# Altium schematic sheet Motor-Y.SchDoc: Motor-Y
size Letter; DocumentNumber: 3; SheetNumber: 6; SheetTotal: 11
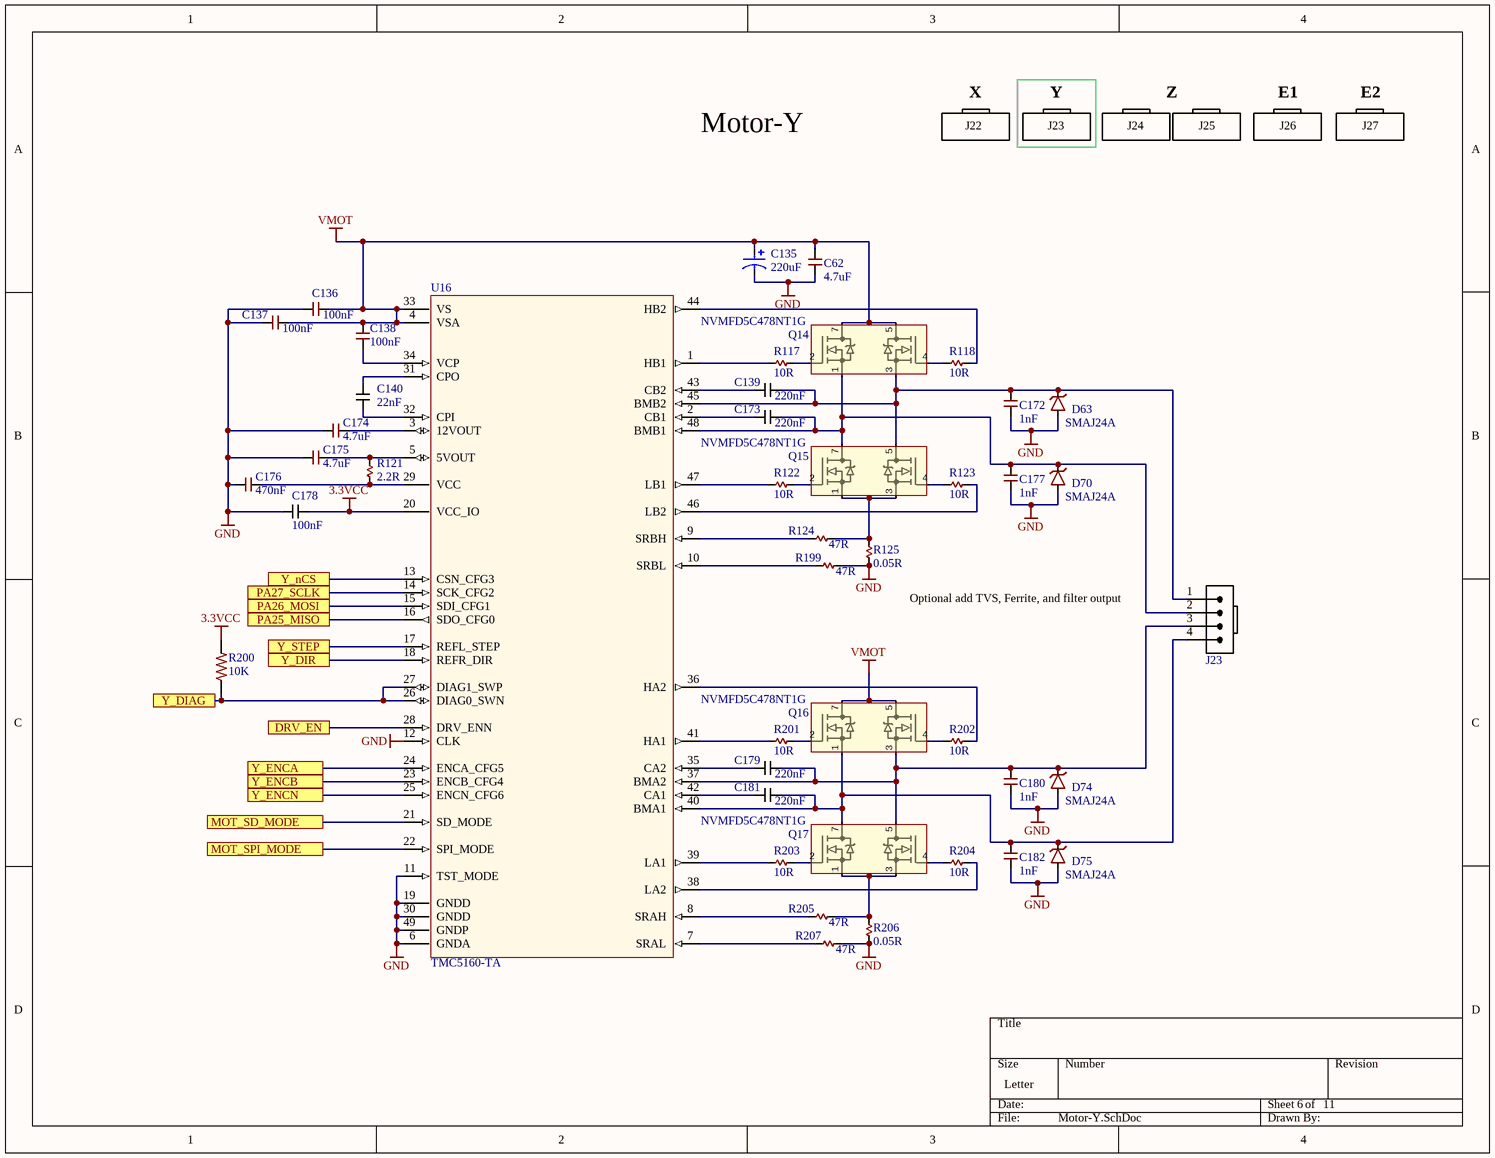
[diagram p0: Motor-Y.SchDoc]

## Parts
C62  4.7uF  [C1206]
C135  220uF  [CAP10X10]
C136  100nF  [C0603]
C137  100nF  [C0603]
C138  100nF  [C0603]
C139  220nF  [C0603]
C140  22nF  [C0603]
C172  1nF  [C0603]
C173  220nF  [C0603]
C174  4.7uF  [C1206]
C175  value 4.7uF  [C0603]  (hidden comment: 4.7uF 6.3V 0603)
C176  value 470nF  [C0402]  (hidden comment: 0402)
C177  1nF  [C0603]
C178  100nF  [C0201 Large Pads]
C179  220nF  [C0603]
C180  1nF  [C0603]
C181  220nF  [C0603]
C182  1nF  [C0603]
D63  SMAJ24A  [SMA-SM]
D70  SMAJ24A  [SMA-SM]
D74  SMAJ24A  [SMA-SM]
D75  SMAJ24A  [SMA-SM]
J23  Molex 0705430003  [4POL254 PIN-IN-PASTE]  (value not drawn)
Q14  NVMFD5C478NT1G  [SO8FL-Dual (DFN8 5x6, 1.26P Dual Flag)]
Q15  NVMFD5C478NT1G  [SO8FL-Dual (DFN8 5x6, 1.26P Dual Flag)]
Q16  NVMFD5C478NT1G  [SO8FL-Dual (DFN8 5x6, 1.26P Dual Flag)]
Q17  NVMFD5C478NT1G  [SO8FL-Dual (DFN8 5x6, 1.26P Dual Flag)]
R117  10R  [R0402]
R118  10R  [R0402]
R121  2.2R  [R0402]
R122  10R  [R0402]
R123  10R  [R0402]
R124  47R  [R0402]
R125  0.05R  [R2512]
R199  47R  [R0402]
R200  10K  [R0402]
R201  10R  [R0402]
R202  10R  [R0402]
R203  10R  [R0402]
R204  10R  [R0402]
R205  47R  [R0402]
R206  0.05R  [R2512]
R207  47R  [R0402]
U16  TMC5160-TA  [TQFP48-EP]

## Ports
DRV_EN, MOT_SD_MODE, MOT_SPI_MODE, PA25_MISO, PA26_MOSI, PA27_SCLK, Y_DIAG, Y_DIR, Y_ENCA, Y_ENCB, Y_ENCN, Y_nCS, Y_STEP

## Nets
3.3VCC: C178.2 R200.2 U16.20(VCC_IO)
GND: C62.1 C135.2 C136.1 C137.1 C172.1 C174.1 C175.1 C176.1 C177.1 C178.1 C180.1 C182.1 D63.A D70.A D74.A D75.A R125.1 R199.2 R206.1 R207.2 U16.6(GNDA) U16.11(TST_MODE) U16.12(CLK) U16.19(GNDD) U16.30(GNDD) U16.49(GNDP)
VMOT: C62.2 C135.1 C136.2 C137.2 C138.2 Q14.5(D1) Q14.7(D2) Q16.5(D1) Q16.7(D2) U16.4(VSA) U16.33(VS)
DRV_EN: U16.28(DRV_ENN) ; port DRV_EN
MOT_SD_MODE: U16.21(SD_MODE) ; port MOT_SD_MODE
MOT_SPI_MODE: U16.22(SPI_MODE) ; port MOT_SPI_MODE
PA25_MISO: U16.16(SDO_CFG0) ; port PA25_MISO
PA26_MOSI: U16.15(SDI_CFG1) ; port PA26_MOSI
PA27_SCLK: U16.14(SCK_CFG2) ; port PA27_SCLK
Y_DIAG: R200.1 U16.26(DIAG0_SWN) U16.27(DIAG1_SWP) ; port Y_DIAG
Y_DIR: U16.18(REFR_DIR) ; port Y_DIR
Y_ENCA: U16.24(ENCA_CFG5) ; port Y_ENCA
Y_ENCB: U16.23(ENCB_CFG4) ; port Y_ENCB
Y_ENCN: U16.25(ENCN_CFG6) ; port Y_ENCN
Y_nCS: U16.13(CSN_CFG3) ; port Y_nCS
Y_STEP: U16.17(REFL_STEP) ; port Y_STEP
NetC138_1: C138.1 U16.34(VCP)
NetC139_1: C139.1 U16.43(CB2)
NetC139_2: C139.2 C172.2 D63.K J23.1 Q14.3(S1) Q15.5(D1) U16.45(BMB2)
NetC140_1: C140.1 U16.32(CPI)
NetC140_2: C140.2 U16.31(CPO)
NetC173_1: C173.1 U16.2(CB1)
NetC173_2: C173.2 C177.2 D70.K J23.2 Q14.1(S2) Q15.7(D2) U16.48(BMB1)
NetC174_2: C174.2 U16.3(12VOUT)
NetC175_2: C175.2 R121.2 U16.5(5VOUT)
NetC176_2: C176.2 R121.1 U16.29(VCC)
NetC179_1: C179.1 U16.35(CA2)
NetC179_2: C179.2 C180.2 D74.K J23.3 Q16.3(S1) Q17.5(D1) U16.37(BMA2)
NetC181_1: C181.1 U16.42(CA1)
NetC181_2: C181.2 C182.2 D75.K J23.4 Q16.1(S2) Q17.7(D2) U16.40(BMA1)
NetQ14_2: Q14.2(G2) R117.2
NetQ14_4: Q14.4(G1) R118.1
NetQ15_1: Q15.1(S2) Q15.3(S1) R124.2 R125.2
NetQ15_2: Q15.2(G2) R122.2
NetQ15_4: Q15.4(G1) R123.1
NetQ16_2: Q16.2(G2) R201.2
NetQ16_4: Q16.4(G1) R202.1
NetQ17_1: Q17.1(S2) Q17.3(S1) R205.2 R206.2
NetQ17_2: Q17.2(G2) R203.2
NetQ17_4: Q17.4(G1) R204.1
NetR117_1: R117.1 U16.1(HB1)
NetR118_2: R118.2 U16.44(HB2)
NetR122_1: R122.1 U16.47(LB1)
NetR123_2: R123.2 U16.46(LB2)
NetR124_1: R124.1 U16.9(SRBH)
NetR199_1: R199.1 U16.10(SRBL)
NetR201_1: R201.1 U16.41(HA1)
NetR202_2: R202.2 U16.36(HA2)
NetR203_1: R203.1 U16.39(LA1)
NetR204_2: R204.2 U16.38(LA2)
NetR205_1: R205.1 U16.8(SRAH)
NetR207_1: R207.1 U16.7(SRAL)

## Notes on the sheet
- X
- Y
- Z
- E1
- E2
- Motor-Y
- J22
- J23
- J24
- J25
- J26
- J27
- (near J23) Optional add TVS, Ferrite, and filter output

## Library data of the parts
C62 C174 = 4.7uF 1206 50V X5R: CAP CER 1206 4.7uF 50V 10% X5R; MANUFACTURER: Kemet; MANUFACTURER #: C1206C475K5PACTU; PART: 4.7uF 50V X5R 1206; PART DESCRIPTION: 4.7µF ±10% 50V Ceramic Capacitor X5R 1206 (3216 Metric); DISTRIBUTOR #: 399-5507-2-ND; DISTRIBUTOR: Digikey; TOLERANCE: 10%; EE_SPEC: 50V; VALUE: 4.7uF
C135 = 220uF Al-El 50V: CAP ALUM 220UF 20% 50V SMD; MANUFACTURER #: UCW1H221MNL1GS; MANUFACTURER: Nichicon; PART DESCRIPTION: 220µF 50V Aluminum Electrolytic Capacitors Radial, Can - SMD 7000 Hrs @ 105°C; EE_SPEC: 365mA@120Hz 730mA@100kHz 350mOhms; DISTRIBUTOR #: 493-9426-2-ND; DISTRIBUTOR: Digikey; PART: 220uF; TOLERANCE: 20%; VALUE: 220uF
C136-C138 = 100nF 0603 50V X7R: CAP CER 0603 100nF 50V 10% X7R; MANUFACTURER: Kemet; MANUFACTURER #: C0603C104K5RACTU; PART: 100nF 50V X7R 0603; PART DESCRIPTION: 0.10µF ±10% 50V Ceramic Capacitor X7R 0603 (1608 Metric); DISTRIBUTOR #: 399-5089-2-ND; DISTRIBUTOR: Digikey; TOLERANCE: 10%; EE_SPEC: 50V; VALUE: 100nF
C139 C173 C179 C181 = 220nF 50V X7R 0603: CAP CER 0.22UF 50V X7R 0603; MANUFACTURER: TDK; MANUFACTURER #: CGA3E3X7R1H224K080AB; PART DESCRIPTION: 0.22µF ±10% 50V Ceramic Capacitor X7R 0603 (1608 Metric); EE_SPEC: 50V X7R; VALUE: 220nF
C140 = 22nF 100V X7R 0603: CAP CER 0.022UF 100V X7R 0603; MANUFACTURER: Kemet; MANUFACTURER #: C0603C223K1RACTU; PART DESCRIPTION: 0.022µF ±10% 100V Ceramic Capacitor X7R 0603 (1608 Metric); EE_SPEC: 100 X7R; VALUE: 22nF
C172 C177 C180 C182 = 1nF 50V X7R 0603: CAP CER 0603  1nF 50v 10% X7R; Manufacturer: Kemet; MANUFACTURER #: C0603C102K5RACTU; Part Description: 1000pF ±10% 50V Ceramic Capacitor X7R 0603 (1608 Metric); Tolerance: +/- 10%; VALUE: 1nF; DISTRIBUTOR #: 399-1082-2-ND; DISTRIBUTOR: Digi-Key; EE_SPEC: 1nF 50V X7R 0603; PART: 1nF
C175 = 4.7uF 0603 6.3V X7R: CAP CER 4.7UF 6.3V X7R 0603; MANUFACTURER: Samsung; MANUFACTURER #: CL10B475KQ8NQNC; PART DESCRIPTION: 4.7µF ±10% 6.3V Ceramic Capacitor X7R 0603 (1608 Metric); TOLERANCE: 10%; DISTRIBUTOR #: 1276-2087-2-ND; DISTRIBUTOR: Digikey; PART: 4.7uF; EE_SPEC: 6.3V
C176 = 470nF 0402 6.3V X5R: 470nF 6.3v C0402 - GRM155R60J474KE19D; PART DESCRIPTION: 470nF ±10% 6.3V Ceramic Capacitor X5R 0402 (1005 Metric); MANUFACTURER: Murata; PART: 0.47uF 6.3V X5R 0402; TOLERANCE: 10%; EE_SPEC: 6.3V; MANUFACTURER #: GRM155R60J474KE19D; DISTRIBUTOR #: 490-3266-2-ND; DISTRIBUTOR: Digikey
C178 = 100nF 6.3V X5R 0201: CAP CER 0.1UF 6.3V 10% X5R 0201; MANUFACTURER: Samsung; MANUFACTURER #: CL03A104KQ3NNNC; VALUE: 100nF; DISTRIBUTOR: DIGI-KEY; DISTRIBUTOR #: 1276-1013-1-ND; TOLERANCE: 10%; VOLTAGE: 6.3V
D63 D70 D74 D75 = SMAJ24A: TVS DIODE 24V 38.9V SMA; Manufacturer: Bourns Inc; EE_SPEC: 24Vrs 38.9Vc; MANUFACTURER #: SMAJ24A; DISTRIBUTOR #: SMAJ24ABTR-ND; DISTRIBUTOR: Digi-Key; Part Description: TVS DIODE 24V 38.9V SMA; VALUE: SMAJ24A
J23 = Molex 0705430003 PIP: Molex 4 Pin Clip Connector - Pin In Paste footprint
Q14-Q17 = NVMFD5C478NT1G: 40V 17 MOHM T6 S08FL DUAL; MANUFACTURER: ON Semiconductor; PART DESCRIPTION: Mosfet Array 2 N-Channel (Dual) 40V 9.8A (Ta), 27A (Tc) 3.1W (Ta), 23W (Tc) Surface Mount 8-DFN (5x6) Dual Flag (SO8FL-Dual); TOLERANCE: -NA-; MANUFACTURER #: NVMFD5C478NT1G; DISTRIBUTOR #: NVMFD5C478NT1GOSCT-ND; DISTRIBUTOR: Digikey; VALUE: NVMFD5C478NT1G; EE_SPEC: 40V 17 MOHM
R117 R118 R122 R123 R201-R204 = 10R 1% 0402: RES SMD 10 OHM 1% 1/16W 0402; MANUFACTURER: Yageo; MANUFACTURER #: RC0402FR-0710RL; PART DESCRIPTION: 10 Ohm ±1% 0.063W, 1/16W Chip Resistor 0402 (1005 Metric) Moisture Resistant Thick Film; DISTRIBUTOR #: 311-10.0LRTR-ND; DISTRIBUTOR: Digikey; PART: 10R 1% 0402; TOLERANCE: 1%; EE_SPEC: 1/16W; VALUE: 10R
R121 = 2.2R 5% 0402: RES SMD 2.2 OHM 5% 1/16W 0402; MANUFACTURER: Yageo; MANUFACTURER #: RC0402JR-072R2L; Part Description: 2.2 Ohms ±5% 0.063W, 1/16W Chip Resistor 0402 (1005 Metric) Moisture Resistant Thick Film; Tolerance: +/- 5%; VALUE: 2.2R; EE_SPEC: 2.2R 5% 0402
R124 R199 R205 R207 = 47R 1% 0402: RES 47 OHM 1% 1/16W 0402; MANUFACTURER: Vishay Dale; MANUFACTURER #: CRCW040247R0FKEDC; Part Description: 47 Ohms ±1% 0.063W, 1/16W Chip Resistor 0402 (1005 Metric)  Thick Film; Tolerance: +/- 1%; VALUE: 47R; EE_SPEC: 47R 1% 0402
R125 R206 = 0.05R 1% 2512: RES 0.05 OHM 1% 2W 2512; MANUFACTURER: Stackpole; MANUFACTURER #: CSRN2512FK50L0; Part Description: 50 mOhms ±1% 2W Chip Resistor 2512 (6432 Metric) Current Sense Thick Film; Tolerance: +/- 1%; VALUE: 0.05R; EE_SPEC: 0.05R 1% 2512
R200 = RC0402FR-0710KP: RES SMD 10K OHM 1% 1/16W 0402; MANUFACTURER: Yageo; PART: 10k 1% 0402; PART DESCRIPTION: 10k Ohm ±1% 0.063W, 1/16W Chip Resistor 0402 (1005 Metric) Moisture Resistant Thick Film; VALUE: 10K; MANUFACTURER #: RC0402FR-0710KP; DISTRIBUTOR #: YAG1249TR-ND; DISTRIBUTOR: Digi-Key Electronics; TOLERANCE: 1%; EE_SPEC: 1/16W
U16 = TMC5160-TA: IC STEPPER MOTOR DVR TQFP48-EP; MANUFACTURER: Trinamic; EE_SPEC: 60V 1/256 Step; VALUE: TMC5160-TA; MANUFACTURER #: TMC5160-TA; Part Description: IC STEPPER MOTOR DVR TQFP48-EP